# Altium schematic sheet Sheet2.SchDoc
size A0; SheetNumber: 1; SheetTotal: 1
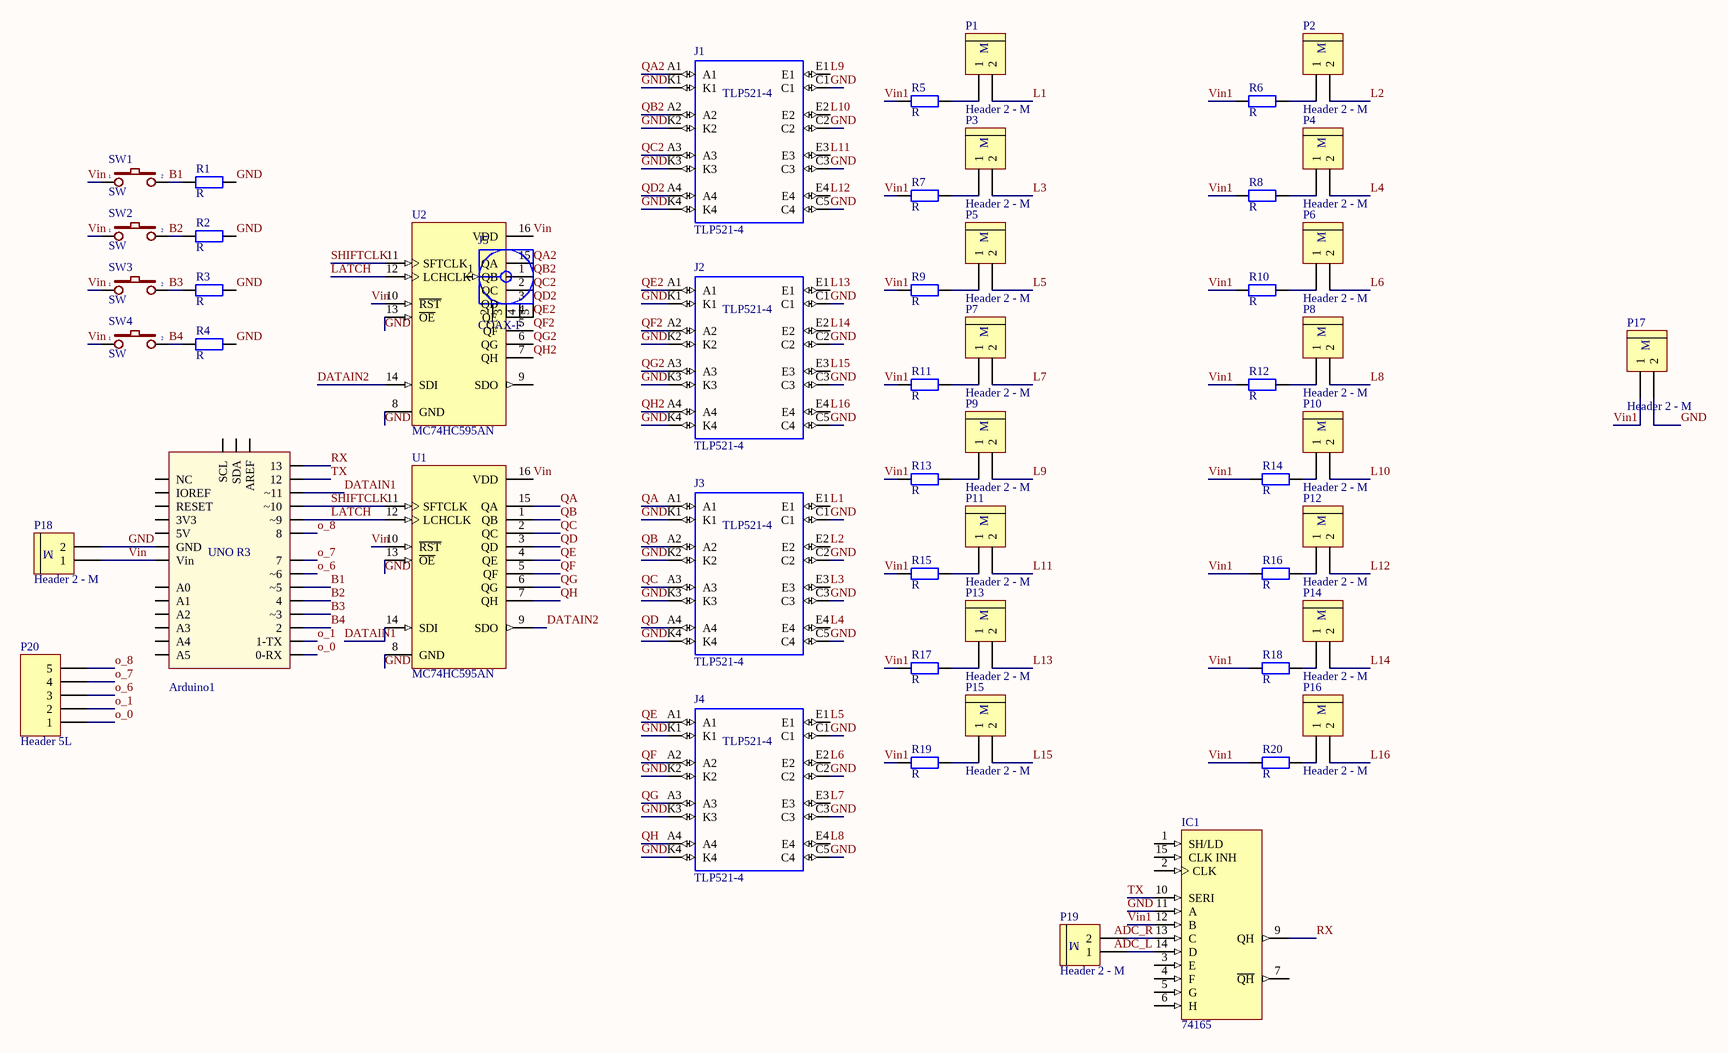
[diagram p0: Sheet2.SchDoc]

## Parts
Arduino1  Arduino Uno R3  [Arduino UNO R3]  (value not drawn)
IC1  74165  [DIP16]
J1  TLP521-4  [TLP521-4_FOOT]
J2  TLP521-4  [TLP521-4_FOOT]
J3  TLP521-4  [TLP521-4_FOOT]
J4  TLP521-4  [TLP521-4_FOOT]
J5  COAX-F  [MCX5.08-H5]
P1  Header 2 - M  [Medium - Header 2]
P2  Header 2 - M  [Medium - Header 2]
P3  Header 2 - M  [Medium - Header 2]
P4  Header 2 - M  [Medium - Header 2]
P5  Header 2 - M  [Medium - Header 2]
P6  Header 2 - M  [Medium - Header 2]
P7  Header 2 - M  [Medium - Header 2]
P8  Header 2 - M  [Medium - Header 2]
P9  Header 2 - M  [Medium - Header 2]
P10  Header 2 - M  [Medium - Header 2]
P11  Header 2 - M  [Medium - Header 2]
P12  Header 2 - M  [Medium - Header 2]
P13  Header 2 - M  [Medium - Header 2]
P14  Header 2 - M  [Medium - Header 2]
P15  Header 2 - M  [Medium - Header 2]
P16  Header 2 - M  [Medium - Header 2]
P17  Header 2 - M  [Medium - Header 2]
P18  Header 2 - M  [Medium - Header 2]
P19  Header 2 - M  [Medium - Header 2]
P20  Header 5L  [HDR1X5 - L]
R1  value R  [DIEN TRO 1/4 W]  (hidden comment: R0.4W)
R2  value R  [DIEN TRO 1/4 W]  (hidden comment: R0.4W)
R3  value R  [DIEN TRO 1/4 W]  (hidden comment: R0.4W)
R4  value R  [DIEN TRO 1/4 W]  (hidden comment: R0.4W)
R5  value R  [DIEN TRO 1/4 W]  (hidden comment: R0.4W)
R6  value R  [DIEN TRO 1/4 W]  (hidden comment: R0.4W)
R7  value R  [DIEN TRO 1/4 W]  (hidden comment: R0.4W)
R8  value R  [DIEN TRO 1/4 W]  (hidden comment: R0.4W)
R9  value R  [DIEN TRO 1/4 W]  (hidden comment: R0.4W)
R10  value R  [DIEN TRO 1/4 W]  (hidden comment: R0.4W)
R11  value R  [DIEN TRO 1/4 W]  (hidden comment: R0.4W)
R12  value R  [DIEN TRO 1/4 W]  (hidden comment: R0.4W)
R13  value R  [DIEN TRO 1/4 W]  (hidden comment: R0.4W)
R14  value R  [DIEN TRO 1/4 W]  (hidden comment: R0.4W)
R15  value R  [DIEN TRO 1/4 W]  (hidden comment: R0.4W)
R16  value R  [DIEN TRO 1/4 W]  (hidden comment: R0.4W)
R17  value R  [DIEN TRO 1/4 W]  (hidden comment: R0.4W)
R18  value R  [DIEN TRO 1/4 W]  (hidden comment: R0.4W)
R19  value R  [DIEN TRO 1/4 W]  (hidden comment: R0.4W)
R20  value R  [DIEN TRO 1/4 W]  (hidden comment: R0.4W)
SW1  SW  [SW2]
SW2  SW  [SW2]
SW3  SW  [SW2]
SW4  SW  [SW2]
U1  MC74HC595AN  [DIP.100/16/W.300/L.900]
U2  MC74HC595AN  [DIP.100/16/W.300/L.900]

## Nets
GND: Arduino1.GND IC1.8(GND) IC1.11(A) J1.C1 J1.C2 J1.C3 J1.C5(C4) J1.K1 J1.K2 J1.K3 J1.K4 J2.C1 J2.C2 J2.C3 J2.C5(C4) J2.K1 J2.K2 J2.K3 J2.K4 J3.C1 J3.C2 J3.C3 J3.C5(C4) J3.K1 J3.K2 J3.K3 J3.K4 J4.C1 J4.C2 J4.C3 J4.C5(C4) J4.K1 J4.K2 J4.K3 J4.K4 P17.2 P18.2 R1.2 R2.2 R3.2 R4.2 U1.8(GND) U1.13(~{OE}) U2.8(GND) U2.13(~{OE})
VCC: IC1.16(VCC)
B1: Arduino1.~5 R1.1 SW1.2
B2: Arduino1.4 R2.1 SW2.2
B3: Arduino1.~3 R3.1 SW3.2
B4: Arduino1.2 R4.1 SW4.2
DATAIN1: Arduino1.~11 U1.14(SDI)
DATAIN2: U1.9(SDO) U2.14(SDI)
L1: J3.E1 P1.2
L2: J3.E2 P2.2
L3: J3.E3 P3.2
L4: J3.E4 P4.2
L5: J4.E1 P5.2
L6: J4.E2 P6.2
L7: J4.E3 P7.2
L8: J4.E4 P8.2
L9: J1.E1 P9.2
L10: J1.E2 P10.2
L11: J1.E3 P11.2
L12: J1.E4 P12.2
L13: J2.E1 P13.2
L14: J2.E2 P14.2
L15: J2.E3 P15.2
L16: J2.E4 P16.2
LATCH: Arduino1.~9 U1.12(LCHCLK) U2.12(LCHCLK)
o_0: Arduino1.0-RX P20.1
o_1: Arduino1.1-TX P20.2
o_6: Arduino1.~6 P20.3
o_7: Arduino1.7 P20.4
o_8: Arduino1.8 P20.5
QA: J3.A1 U1.15(QA)
QA2: J1.A1 U2.15(QA)
QB: J3.A2 U1.1(QB)
QB2: J1.A2 U2.1(QB)
QC: J3.A3 U1.2(QC)
QC2: J1.A3 U2.2(QC)
QD: J3.A4 U1.3(QD)
QD2: J1.A4 U2.3(QD)
QE: J4.A1 U1.4(QE)
QE2: J2.A1 J5.5(GND) U2.4(QE)
QF: J4.A2 U1.5(QF)
QF2: J2.A2 U2.5(QF)
QG: J4.A3 U1.6(QG)
QG2: J2.A3 U2.6(QG)
QH: J4.A4 U1.7(QH)
QH2: J2.A4 U2.7(QH)
RX: Arduino1.13 IC1.9(QH)
SHIFTCLK: Arduino1.~10 U1.11(SFTCLK) U2.11(SFTCLK)
TX: Arduino1.12 IC1.10(SERI)
Vin: Arduino1.Vin P18.1 SW1.1 SW2.1 SW3.1 SW4.1 U1.10(~{RST}) U1.16(VDD) U2.10(~{RST}) U2.16(VDD)
Vin1: IC1.12(B) P17.1 R5.1 R6.1 R7.1 R8.1 R9.1 R10.1 R11.1 R12.1 R13.1 R14.1 R15.1 R16.1 R17.1 R18.1 R19.1 R20.1
NetIC1_13: IC1.13(C) P19.2
NetIC1_14: IC1.14(D) P19.1
NetP1_1: P1.1 R5.2
NetP2_1: P2.1 R6.2
NetP3_1: P3.1 R7.2
NetP4_1: P4.1 R8.2
NetP5_1: P5.1 R9.2
NetP6_1: P6.1 R10.2
NetP7_1: P7.1 R11.2
NetP8_1: P8.1 R12.2
NetP9_1: P9.1 R13.2
NetP10_1: P10.1 R14.2
NetP11_1: P11.1 R15.2
NetP12_1: P12.1 R16.2
NetP13_1: P13.1 R17.2
NetP14_1: P14.1 R18.2
NetP15_1: P15.1 R19.2
NetP16_1: P16.1 R20.2

Not connected (* = marked no-connect by the designer): Arduino1 3V3 5V A0 A1 A2 A3 A4 A5 AREF IOREF NC RESET SCL SDA; IC1 1(SH/LD) 2(CLK) 3(E) 4(F) 5(G) 6(H) 7(~{QH}) 15(CLK_INH); J5 1(Signal) 2(GND) 3(GND) 4(GND); U2 9(SDO)

## Notes on the sheet
- Labels drawn without touching a wire or pin: ADC_L, ADC_R
- (in symbol Arduino Uno R3) UNO R3
- (in symbol Header 2 - M) M

## Library data of the parts
Arduino1 = Arduino Uno R3: Value: Cau 1A
IC1 = 74165: 8-Bit Parallel In/Serial Out Shift Register
J1-J4 = TLP521-4: Optoisolator Transistor Output 5300Vrms 4 Channel 16-DIP; MF: Isocom Components; MP: TLP521-4; Purchase-URL: https://pricing.snapeda.com/search/part/TLP521-4/?ref=eda; SnapEDA_Link: https://www.snapeda.com/parts/TLP521-4/Isocom/view-part/?ref=snap; Package: SMD-16 Isocom Components; Check_prices: https://www.snapeda.com/parts/TLP521-4/Isocom/view-part/?ref=eda; Digi-Key_Part_Number: TLP521-4X-ND; Value: *
J5 = COAX-F: RF Coaxial PCB Connector, MCX; Thru-Hole, Right-Angle Mount Socket, Blunt Post Terminal, 50 Ohm Impedance; PCB_Layout: Complies with manufacturer's recommendation.; DrillSize: Corresponds to nominal value.; Published: 15-Jul-2004; LatestRevisionDate: 15-Jul-2004; LatestRevisionNote: Component Replaced.; DatasheetDocument: 30-May-2003; PackageDocument: 04-Jul-1999; PackageReference: 919-119J-51AX; Publisher: Altium Limited; ComponentLink1Description: Manufacturer Link; ComponentLink1URL: http://www.amphenolrf.com/
P1-P19 = Header 2 - M: Header, 2-Pin, Medium; LatestRevisionDate: 17-Jul-2002; LatestRevisionNote: Re-released for DXP Platform.; Publisher: Altium Limited
P20 = Header 5L: Header, 5-Pin; LatestRevisionDate: 17-Jul-2002; LatestRevisionNote: Re-released for DXP Platform.; Publisher: Altium Limited
R1-R20 = Res 1/4 W: Resistor; Published: 8-Jun-2000; LatestRevisionDate: 17-Jul-2002; LatestRevisionNote: Re-released for DXP Platform.; PackageReference: AXIAL-0.4; Publisher: Altium Limited
SW1-SW4 = SW2: Switch button 2 pin; Value: SW chip 2 pin
U1 U2 = MC74HC595AN: 8-Bit Serial-Input/Serial or Prallel-Output Shift Register with Latched 3-State Outputs; Published: 15-Apr-2002; DatasheetVersion: Mar-2000; PackageVersion: Apr-2000; PackageReference: 648-08; Publisher: Altium Limited; PackageDescription: DIP; 16 Leads; Row Spacing 7.62 mm; Pitch 2.54 mm; Code_JEDEC: MS-001-BB; ComponentLink1Description: Manufacturer Link; ComponentLink1URL: http://www.onsemi.com/; ComponentLink2Description: Datasheet; ComponentLink2URL: http://www.onsemi.com/pub/Collateral/MC74HC595A-D.PDF